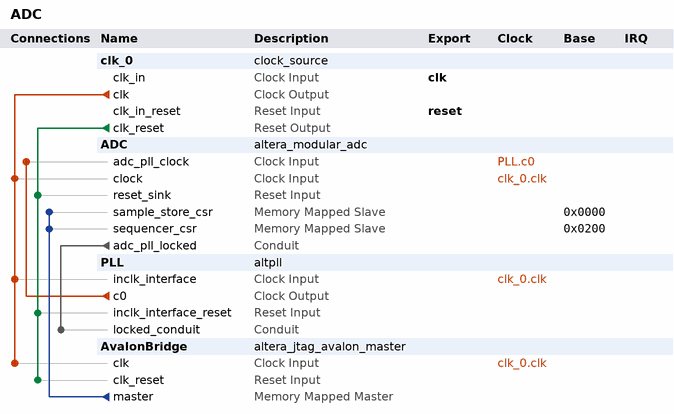
[diagram p0: system contents]
# Platform Designer (Qsys) system ADC, MAX 10 10M50DAF484C7G
# Parameters at their usual value, and those the tool derives, are not listed.
package require -exact qsys 18.1
create_system ADC
set_project_property DEVICE_FAMILY {MAX 10}
set_project_property DEVICE 10M50DAF484C7G

add_instance clk_0 clock_source 18.1
set_instance_parameter_value clk_0 clockFrequency 50000000

add_instance ADC altera_modular_adc 18.1
set_instance_parameter_value ADC CLOCK_FREQ 50000000
set_instance_parameter_value ADC CORE_VAR 0
set_instance_parameter_value ADC DEVICE_PART 10M50DAF484C7G
set_instance_parameter_value ADC clkdiv 2
set_instance_parameter_value ADC enable_usr_sim 1
set_instance_parameter_value ADC int_vref_vr 3.0
set_instance_parameter_value ADC refsel 1
set_instance_parameter_value ADC sample_rate 0
set_instance_parameter_value ADC seq_order_length 1
set_instance_parameter_value ADC seq_order_slot_1 0
set_instance_parameter_value ADC seq_order_slot_2 30
set_instance_parameter_value ADC seq_order_slot_3 30
set_instance_parameter_value ADC seq_order_slot_4 30
set_instance_parameter_value ADC seq_order_slot_5 30
set_instance_parameter_value ADC seq_order_slot_6 30
set_instance_parameter_value ADC seq_order_slot_7 30
set_instance_parameter_value ADC simfilename_ch0 C:/Users/Jon/Documents/adc_sample_sinwave_1KHz_tab_delimited_50_SAMPLES.txt
set_instance_parameter_value ADC use_ch0 true
set_instance_parameter_value ADC use_ch1 false
set_instance_parameter_value ADC use_ch2 false
set_instance_parameter_value ADC use_ch3 false
set_instance_parameter_value ADC use_ch4 false
set_instance_parameter_value ADC use_ch5 false
set_instance_parameter_value ADC use_ch6 false
set_instance_parameter_value ADC use_ch7 false
set_instance_parameter_value ADC use_ch8 false
set_instance_parameter_value ADC use_tsd false

add_instance PLL altpll 18.1
set_instance_parameter_value PLL CLK0_DIVIDE_BY 5
set_instance_parameter_value PLL CLK0_MULTIPLY_BY 1
set_instance_parameter_value PLL INCLK0_INPUT_FREQUENCY 20000
set_instance_parameter_value PLL PORT_ARESET PORT_USED
set_instance_parameter_value PLL PORT_LOCKED PORT_USED
set_instance_parameter_value PLL PORT_clk1 PORT_UNUSED
set_instance_parameter_value PLL PORT_clk2 PORT_UNUSED
set_instance_parameter_value PLL PORT_clk3 PORT_UNUSED

add_instance AvalonBridge altera_jtag_avalon_master 18.1

# connections
add_connection clk_0.clk ADC.clock clock
add_connection clk_0.clk AvalonBridge.clk clock
add_connection clk_0.clk PLL.inclk_interface clock
add_connection PLL.c0 ADC.adc_pll_clock clock
add_connection clk_0.clk_reset ADC.reset_sink reset
add_connection clk_0.clk_reset AvalonBridge.clk_reset reset
add_connection clk_0.clk_reset PLL.inclk_interface_reset reset
add_connection AvalonBridge.master ADC.sample_store_csr avalon
set_connection_parameter_value AvalonBridge.master/ADC.sample_store_csr baseAddress 0x0000
add_connection AvalonBridge.master ADC.sequencer_csr avalon
set_connection_parameter_value AvalonBridge.master/ADC.sequencer_csr baseAddress 0x0200
add_connection ADC.adc_pll_locked PLL.locked_conduit conduit

# exported interfaces
add_interface clk clock sink
set_interface_property clk EXPORT_OF clk_0.clk_in
add_interface reset reset sink
set_interface_property reset EXPORT_OF clk_0.clk_in_reset

set_interconnect_requirement {$system} qsys_mm.clockCrossingAdapter HANDSHAKE
set_interconnect_requirement {$system} qsys_mm.enableEccProtection FALSE
set_interconnect_requirement {$system} qsys_mm.insertDefaultSlave FALSE
set_interconnect_requirement {$system} qsys_mm.maxAdditionalLatency 1

save_system ADC.qsys
